# EAGLE design STLink-Adapter (EAGLE 9.6.2)
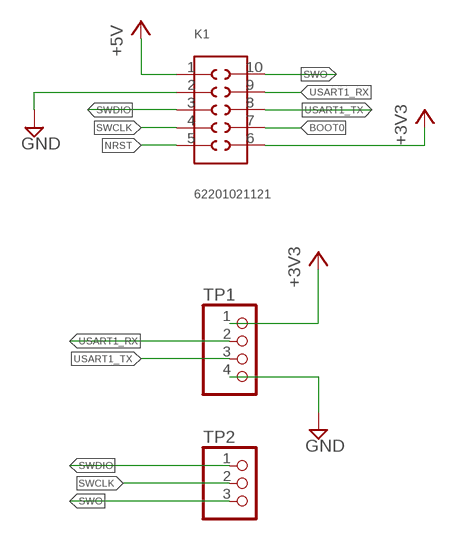
[diagram p0: schematic, sheet 1]

## Parts
K1  62201021121  [62201021121]
TP1  TP-1X4  [1X04]
TP2  TP-1X3  [1X03]

## Nets
+3V3 [power]: K1.6 TP1.1
+5V [power]: K1.1
BOOT0: K1.7
GND [motor]: K1.2 TP1.4
NRST: K1.5
SWCLK: K1.4 TP2.2
SWDIO: K1.3 TP2.1
SWO: K1.10 TP2.3
USART1_RX: K1.9 TP1.2
USART1_TX: K1.8 TP1.3

## Library data of the parts
K1 = pinheader_1m27:62201021121: WR-PHD 1.27mm Dual Pin Header, 10 Pins=>Code : Con_BTB_PHD_1.27_2_62201021121 <http://katalog.we-online.de/media/thumbs2/eican/thb_Con_BTB_PHD_1.27_2_6220xx21121_pf2.jpg> Details see: http://katalog.we-online.de/en/em/622_0xx_211_21 Created 2014-06-03, Karrer Zheng 2014 (C) Würth Elektronik
TP1 = pad:TP-1X4
TP2 = pad:TP-1X3

## Net classes
1 power: width 0.152 mm
2 motor: width 0.152 mm

## Board
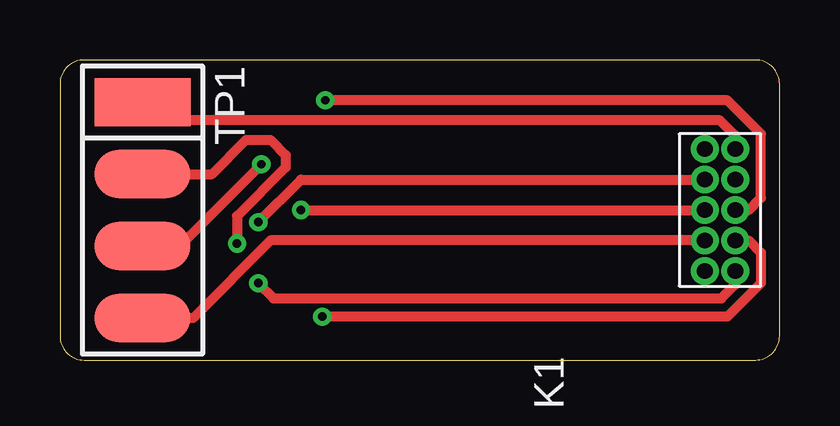
[diagram p1: board, top side]
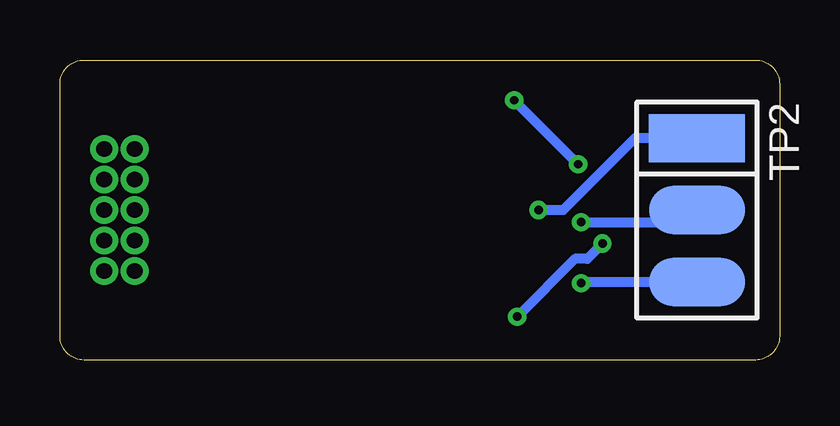
[diagram p2: board, bottom side, seen from below]

Size 30 x 12.5 mm. Coordinates in mm from the lower left corner, seen from the top.
Outline: 30,1 30,11.5 arc90 29,12.5 1,12.5 arc90 0,11.5 0,1 arc90 1,0 29,0 arc90 30,1
Copper layers (1*16): Top 0.035mm / dielectric 1.5mm / Bottom 0.035mm
Design rules "default *": minimum track width 6mil, minimum drill 0.35mm, track to track 4mil, track to pad 4mil, pad to pad 4mil, via to via 4mil, smd to smd 6mil, copper to edge 10mil, drill to drill 6mil, minimum pad ring 10mil, minimum via ring 8mil, stop-mask expansion 4mil, vias tented up to drill 100mil, thermal gap 10mil

### Footprints (pad centres in the part's own frame; a part is rotated, then mirrored left to right if it is on the bottom)
62201021121 = drill 0.65: 1 -2.54,0.635; 2 -1.27,0.635; 3 0,0.635; 4 1.27,0.635; 5 2.54,0.635; 6 2.54,-0.635; 7 1.27,-0.635; 8 0,-0.635; 9 -1.27,-0.635; 10 -2.54,-0.635
1X04 = smd 2 x 4: 1 -4.5,0; 2 -1.5,0; 3 1.5,0; 4 4.5,0
1X03 = smd 2 x 4: 1 -3,0; 2 0,0; 3 3,0

### Placement (x,y rotation side)
K1  27.52,6.25 90 top
TP1  3.44,6.25 270 top
TP2  3.44,6.25 270 bottom

### Tracks (layer width: path | path; a pad name or v marks a point on that pad's centre or on a via)
+3V3
  Top 0.406: TP1.1 4.21,9.99 27.52,9.99 28.16,9.35 K1.6
GND
  Top 0.406: K1.2 8.78,4.98 5.55,1.75 TP1.4
SWCLK  (via drill 0.35)
  Top 0.406: v8.27,5.74 10.05,7.52 K1.4
  Bottom 0.406: TP2.2 3.95,5.74 v8.27,5.74
SWDIO  (via drill 0.35)
  Top 0.406: v10.05,6.25 K1.3
  Bottom 0.406: TP2.1 6.03,9.25 9.03,6.25 v10.05,6.25
SWO  (via drill 0.35)
  Top 0.406: K1.10 28.16,3.15 27.57,2.57 8.9,2.57 v8.27,3.2
  Bottom 0.406: TP2.3 8.22,3.25 v8.27,3.2
USART1_RX  (via drill 0.35)
  Top 0.406: K1.9 28.72,4.98 29.22,4.47 29.22,3.2 27.83,1.8 v10.94,1.8 | TP1.2 6.34,7.75 7.76,9.17 8.78,9.17 9.41,8.54 9.41,8.03 7.38,6 v7.38,4.85
  Bottom 0.406: v7.38,4.85 8.02,4.22 8.52,4.22 v10.94,1.8
USART1_TX  (via drill 0.35)
  Top 0.406: K1.8 28.72,6.25 29.22,6.76 29.22,9.43 27.83,10.82 v11.06,10.82 | TP1.3 4.99,4.75 v8.4,8.15
  Bottom 0.406: v8.4,8.15 v11.06,10.82